# Altium schematic sheet main.SchDoc
size A4
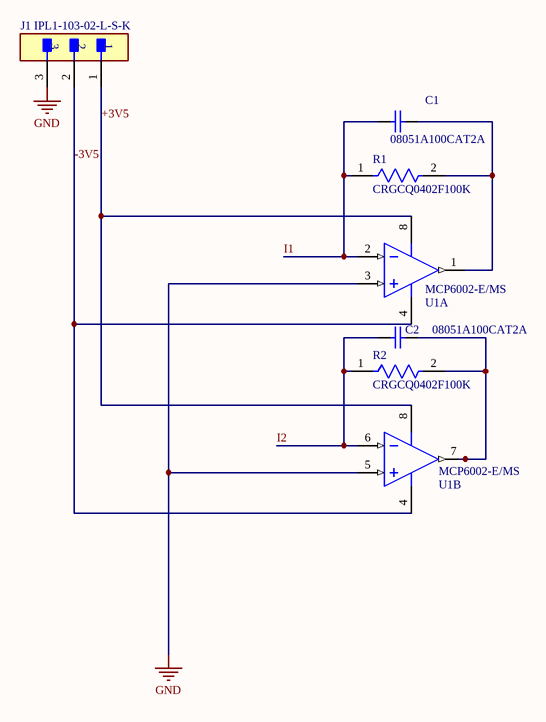
[diagram p0: main.SchDoc]

## Parts
C1  08051A100CAT2A  [CAPC2013X94X50NL20T25]
C2  08051A100CAT2A  [CAPC2013X94X50NL20T25]
J1  IPL1-103-02-L-S-K  [FP-IPL1-103-02-L-S-K-0]
R1  CRGCQ0402F100K  [FP-CRGCQ0402-IPC_C]
R2  CRGCQ0402F100K  [FP-CRGCQ0402-IPC_C]
U1  MCP6002-E/MS  [MSOP-MS8_M]  (parts A,B of 2)

## Nets
GND: J1.3 U1.3(VINA+) U1.5(VINB+)
+3V5: J1.1 U1.8(VDD)
-3V5: J1.2 U1.4(VSS)
I1: C1.1 R1.1 U1.2(VINA-)
I2: C2.1 R2.1 U1.6(VINB-)
NetC1_2: C1.2 R1.2 U1.1(VOUTA)
NetC2_2: C2.2 R2.2 U1.7(VOUTB)

## Library data of the parts
C1 C2 = CMP-2007-04114-1: Manufacturer: AVX Interconnect / Elco; Part Number: 08051A100CAT2A
J1 = CMP-02766-000522-1: 3 Position 1 Row .100" (2.54 mm) pitch connector; Max Voltage Rating (AC): 675V; Gender: Male; Number of Ports: 1; Pitch: 2.54mm; Max Current Rating: 7.4A; Number of Contacts: 3; Mount: Surface Mount; Housing Material: Polymer; Contact Plating: Gold; Packaging: Bulk; Min Operating Temperature: -55°C; Length: 9.14mm; Max Operating Temperature: 125°C; Contact Material: Bronze; Termination: Solder; Radiation Hardening: No; Orientation: Straight; Number of Terminals/Pins: 3; Depth: 7.04mm
R1 R2 = CMP-03211-001412-1: CRGCQ0402 100KΩ 1% ±100ppm/°C 50V; Manufacturer: TE Connectivity; Tolerance: 0.01; Power Rating: 0.0625W; Resistance: 100KΩ; Ambient Temperature Range High: +70°C; Series: CRGCQ; Temperature: -55°C to +155°C; Temperature Range Low: -55°C; ComponentLink2Description: Datasheet; Category: Res; Temperature Range High: +155°C; Automotive: Yes; Device Class L2: Resistors; Height: 0.4mm; Ipc Land Pattern Name: RESC10050X35; Voltage Rating: 50V; ComponentLink2URL: https://www.te.com/commerce/DocumentDelivery/DDEController?Action=showdoc&DocId=Data+Sheet%7F1773204-3%7F1%7Fpdf%7FEnglish%7FENG_DS_1773204-3_1.pdf%7F4-2176347-1150; Composition: Thick Film; Device Class L1: Passive Components; Device Class L3: Chip SMD Resistors; RoHS: TRUE; Temperature Coefficient: ±100ppm/°C; Lead Free: Yes; Value: 100KΩ; Manufacturer Part Number: CRGCQ0402F100K; Octopart: https://octopart.com/crgcq0402f100k-te+connectivity-91017930; Package: CRGCQ0402
U1 = CMP-0187-00576-3: None; Nominal Supply Current: 100uA; Max Supply Voltage: 6V; Amplifier Type: GENERAL PURPOSE; Output Current: 23mA; Gain Bandwidth Product: 1MHz; Number of Channels: 2; Power Supply Rejection Ratio (PSRR): 86dB; Min Supply Voltage: 1.8V; Input Bias Current: 1pA; Input Offset Voltage (Vos): 4.5mV; Operating Supply Voltage: 5.5V; Slew Rate-Nom: 0.6V/µs; Common Mode Rejection Ratio: 60dB; Voltage Gain: 112dB; Mount: Surface Mount; Case/Package: MSOP; Lead Free: Lead Free; Width: 3mm; Radiation Hardening: No; Technology: CMOS; Number of Pins: 8; Supply Current: 100uA; Height: 0.95mm; Number of Elements: 2; Min Operating Temperature: -40°C; Package Quantity: 100; Packaging: Rail/Tube; Max Operating Temperature: 125°C; Slew Rate: 0.6V/µs; RoHS Compliant: Yes; Input Offset Voltage-Max: 4.5mV; Number of Amplifiers: 2; Length: 3mm; Unity Gain Bandwidth Product: 1MHz; REACH SVHC: No SVHC; Bandwidth: 1MHz; Number of Circuits: 2